# Altium schematic sheet Sheet1.SchDoc
size A4
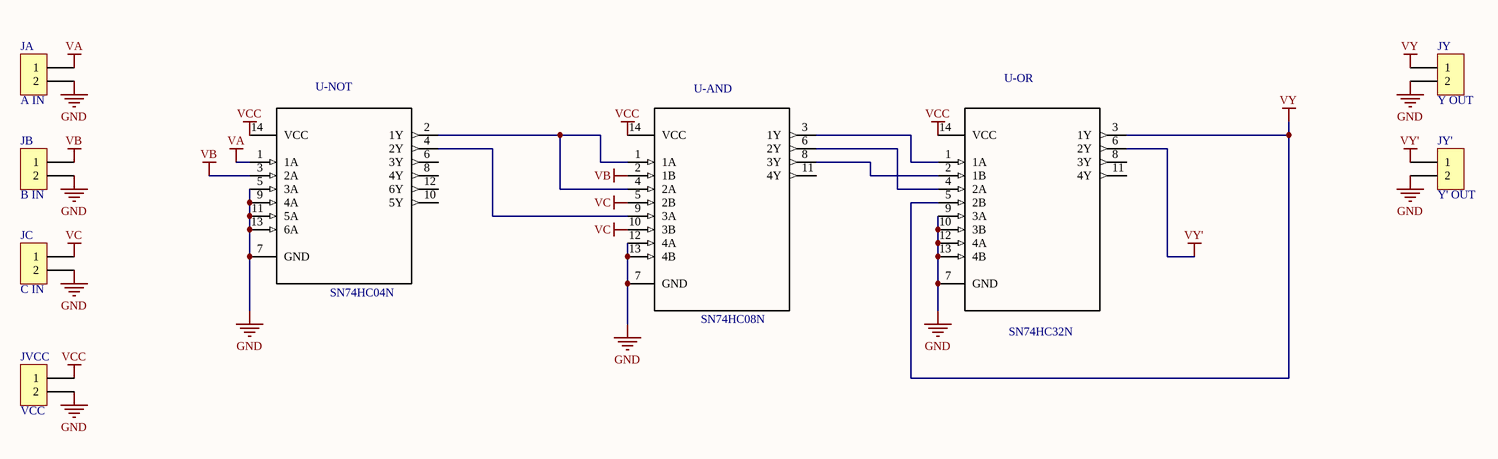
[diagram p0: Sheet1.SchDoc]

## Parts
JA  A IN  [BORNERA2]
JB  B IN  [BORNERA2]
JC  C IN  [BORNERA2]
JVCC  VCC  [BORNERA2]
JY  Y OUT  [BORNERA2]
JY'  Y' OUT  [BORNERA2]
U-AND  SN74HC08N  [*DIP254P762X508-14]
U-NOT  SN74HC04N  [*DIP254P762X508-14]
U-OR  SN74HC32N  [*DIP254P762X508-14]

## Nets
GND: JA.2 JB.2 JC.2 JVCC.2 JY.2 JY'.2 U-AND.7(GND) U-AND.12(4A) U-AND.13(4B) U-NOT.5(3A) U-NOT.7(GND) U-NOT.9(4A) U-NOT.11(5A) U-NOT.13(6A) U-OR.7(GND) U-OR.9(3A) U-OR.10(3B) U-OR.12(4A) U-OR.13(4B)
VA: JA.1 U-NOT.1(1A)
VB: JB.1 U-AND.2(1B) U-NOT.3(2A)
VC: JC.1 U-AND.5(2B) U-AND.10(3B)
VCC: JVCC.1 U-AND.14(VCC) U-NOT.14(VCC) U-OR.14(VCC)
VY: JY.1 U-OR.3(1Y) U-OR.5(2B)
VY': JY'.1 U-OR.6(2Y)
NetU-AND_1: U-AND.1(1A) U-AND.4(2A) U-NOT.2(1Y)
NetU-AND_3: U-AND.3(1Y) U-OR.1(1A)
NetU-AND_6: U-AND.6(2Y) U-OR.4(2A)
NetU-AND_8: U-AND.8(3Y) U-OR.2(1B)
NetU-AND_9: U-AND.9(3A) U-NOT.4(2Y)

Not connected (* = marked no-connect by the designer): U-AND 11(4Y); U-NOT 6(3Y) 8(4Y) 10(5Y) 12(6Y); U-OR 8(3Y) 11(4Y)

## Library data of the parts
JA JB JC JVCC JY JY' = BORNERA 2
U-AND = SN74HC08N: MF: Texas Instruments; Package: PDIP-14 Signetics; Digi-Key_Part_Number: 296-1570-5-ND; MP: SN74HC08N; Digi-Key_Purchase_URL: https://www.digikey.com/product-detail/en/texas-instruments/SN74HC08N/296-1570-5-ND/277216?utm_source=snapeda&utm_medium=aggregator&utm_campaign=symbol; SnapEDA_Link: https://www.snapeda.com/parts/SN74HC08N/Texas%20Instruments/view-part/?ref=snap; Value: *
U-NOT = SN74HC04N: Inverter 6-Element CMOS 14-Pin PDIP Inverter 6-Element CMOS 14-Pin PDIP Inverter 6-Element CMOS 14-Pin PDIP; MF: Texas Instruments; Package: DIP-14 Texas Instruments; Availability: Unavailable; SnapEDA_Link: https://www.snapeda.com/parts/SN74HC04N/Texas%20Instruments/view-part/?ref=snap; MP: SN74HC04N; Price: None; Value: *
U-OR = SN74HC32N: IC: digital; Channels: 4; OR; Inputs: 2; THT; DIP14; Seri; MF: Texas Instruments; MP: SN74HC32N; Package: DIP-14 Texas Instruments; SnapEDA_Link: https://www.snapeda.com/parts/SN74HC32N/Texas%20Instruments/view-part/?ref=snap; Price: None; Availability: Unavailable; Value: *